# Altium project HORNET-1-IPG.PrjPcb
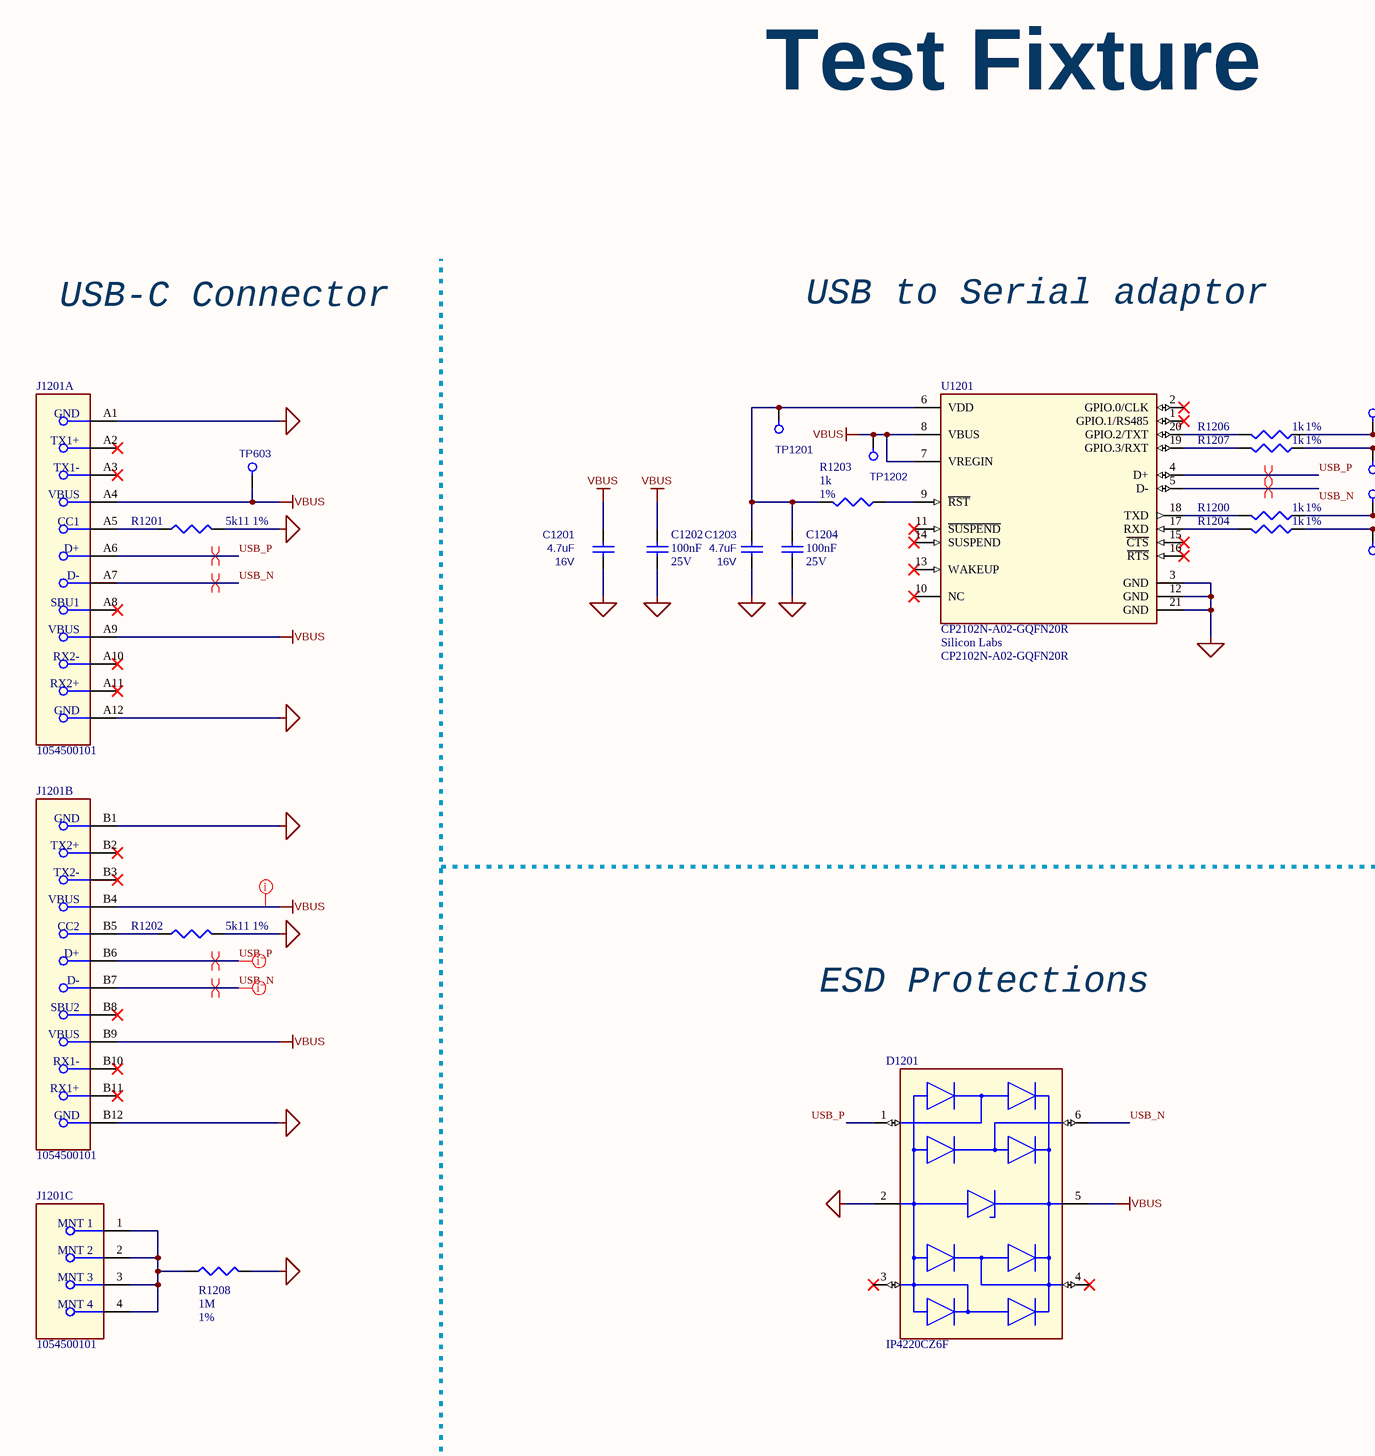
[diagram p0: 14-TestFixture.SchDoc, left]
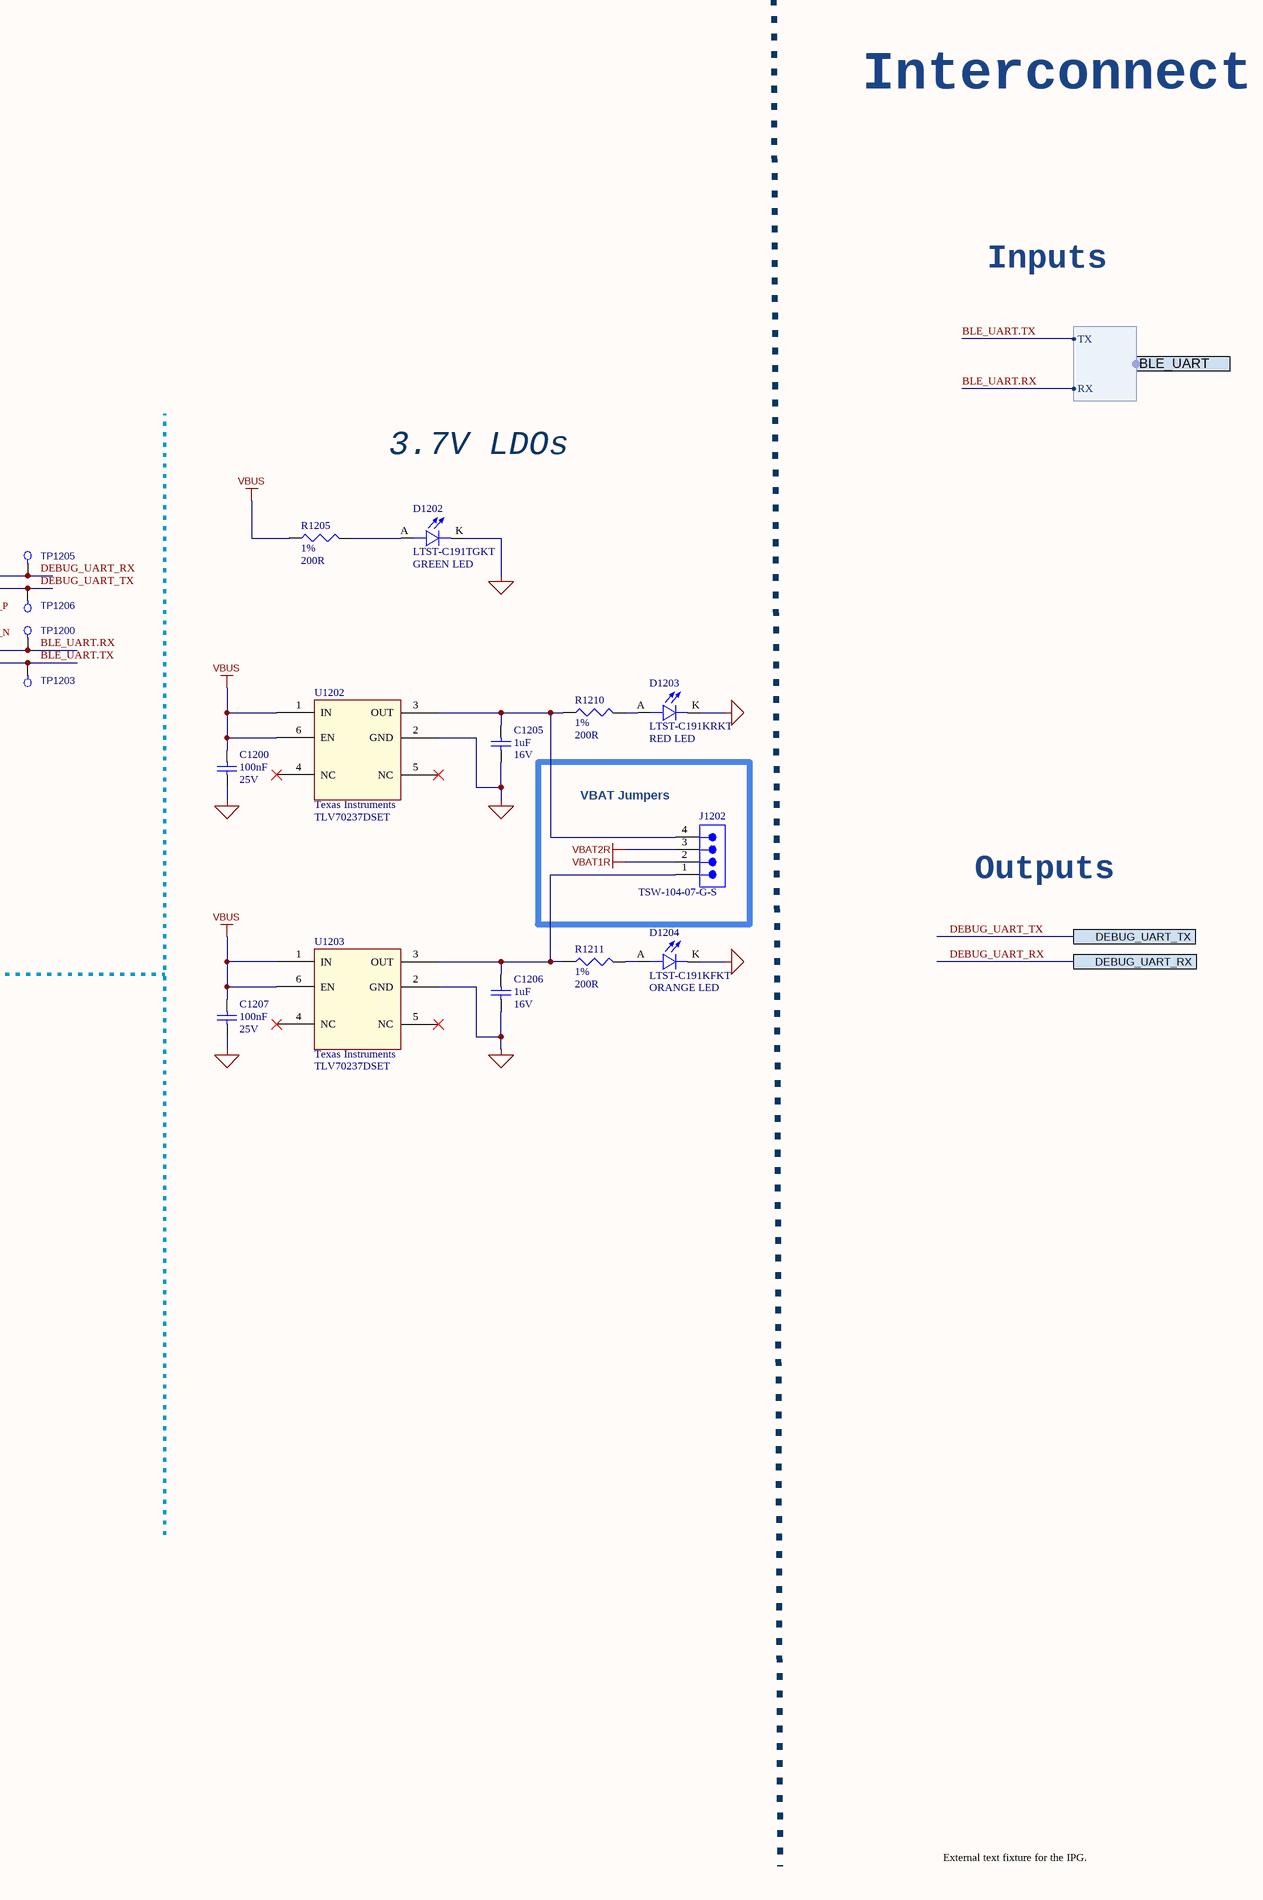
[diagram p1: 14-TestFixture.SchDoc, right]
ApprovedBy: Ricardo Ercoli; Date: 2024-05-16; DateReview1: 2024-05-16; LastDesigner: Mathias Ferreira; LastReviewer: Alvaro Rios; PCBA: HORNET1-IPGV1.4A; Rev: A; VerMay: 1; VerMin: 4
1 sheet, 35 parts. Net scope: flat (ports and power ports of the same name join across sheets).
Board files: HORNET-1-IPG.PcbDoc, non-rigid-reference.PcbDoc

## Sheet 14-TestFixture.SchDoc: Test Fixture
size A2; Date: 26/12/2023; DocumentNumber: 14; SheetNumber: 14; SheetTotal: 15; SPICEModelCacheUDWTZYBE: <root> / <DocumentId>UDWTZYBE</DocumentId> / </root>

### Parts
C1200  value 100nF  Rated DC Voltage (URdc): 25V  [C0201_C]  (hidden comment: GRM033R61E104KE14J)
C1201  value 4.7uF  Rating: 16V  [CAP0603_REDUCED]  (hidden comment: GRM188R61C475KE11)
C1202  value 100nF  Rated DC Voltage (URdc): 25V  [C0201_C]  (hidden comment: GRM033R61E104KE14J)
C1203  value 4.7uF  Rating: 16V  [CAP0603_REDUCED]  (hidden comment: GRM188R61C475KE11)
C1204  value 100nF  Rated DC Voltage (URdc): 25V  [C0201_C]  (hidden comment: GRM033R61E104KE14J)
C1205  value 1uF  Rated DC Voltage (URdc): 16V  [C0201_C]  (hidden comment: GRM033R61C105ME15D)
C1206  value 1uF  Rated DC Voltage (URdc): 16V  [C0201_C]  (hidden comment: GRM033R61C105ME15D)
C1207  value 100nF  Rated DC Voltage (URdc): 25V  [C0201_C]  (hidden comment: GRM033R61E104KE14J)
D1201  IP4220CZ6F  [FP-SOT457-IPC_A]
D1202  LTST-C191TGKT  value GREEN LED  [LEDC0603]
D1203  LTST-C191KRKT  value RED LED  [LEDC0603]
D1204  LTST-C191KFKT  value ORANGE LED  [LEDC0603]
J1201  1054500101  [FP-1054500101-MFG]  (parts A,B,C of 3)
J1202  TSW-104-07-G-S  [SMTC-TSW-104-07-X-S]
R1200  value 1k  Tolerance: 1%  [R0201_C]  (hidden comment: CRCW02011K00FNED)
R1201  value 5k11  Tolerance: 1%  [R0201_C]  (hidden comment: CRCW02015K11FNED)
R1202  value 5k11  Tolerance: 1%  [R0201_C]  (hidden comment: CRCW02015K11FNED)
R1203  value 1k  Tolerance: 1%  [R0201_C]  (hidden comment: CRCW02011K00FNED)
R1204  value 1k  Tolerance: 1%  [R0201_C]  (hidden comment: CRCW02011K00FNED)
R1205  value 200R  Tolerance: 1%  [RES0402_REDUCED]  (hidden comment: CRCW0402200RFKEDHP)
R1206  value 1k  Tolerance: 1%  [R0201_C]  (hidden comment: CRCW02011K00FNED)
R1207  value 1k  Tolerance: 1%  [R0201_C]  (hidden comment: CRCW02011K00FNED)
R1208  value 1M  Tolerance: 1%  [R0201_C]  (hidden comment: CRCW02011M00FNED)
R1210  value 200R  Tolerance: 1%  [RES0402_REDUCED]  (hidden comment: CRCW0402200RFKEDHP)
R1211  value 200R  Tolerance: 1%  [RES0402_REDUCED]  (hidden comment: CRCW0402200RFKEDHP)
TP603  Test Point  [testpad_0.9mm]  (value not drawn)  (no BOM)
TP1200  Test Point  [testpad_0.9mm]  (value not drawn)  (no BOM)
TP1201  Test Point  [testpad_0.9mm]  (value not drawn)  (no BOM)
TP1202  Test Point  [testpad_0.9mm]  (value not drawn)  (no BOM)
TP1203  Test Point  [testpad_0.9mm]  (value not drawn)  (no BOM)
TP1205  Test Point  [testpad_0.9mm]  (value not drawn)  (no BOM)
TP1206  Test Point  [testpad_0.9mm]  (value not drawn)  (no BOM)
U1201  CP2102N-A02-GQFN20R  Manufacturer: Silicon Labs  [FP-CP2102N-A02-GQFN20R-MFG]
U1202  Manufacturer: Texas Instruments  [SON127P600-8N]  (hidden comment: TLV70237DSET)
U1203  Manufacturer: Texas Instruments  [SON127P600-8N]  (hidden comment: TLV70237DSET)

### Ports
BLE_UART (harness UART), DEBUG_UART_RX, DEBUG_UART_TX

### Harnesses
UART: TX, RX

### Nets
GND: C1200.1 C1201.2 C1202.1 C1203.2 C1204.1 C1205.2 C1206.1 C1207.1 D1201.2(GND) D1202.K D1203.K D1204.K J1201.A1(GND) J1201.A12(GND) J1201.B1(GND) J1201.B12(GND) R1201.2 R1202.2 R1208.2 U1201.3(GND) U1201.12(GND) U1201.21(GND) U1202.2(GND) U1203.2(GND)
VBAT1R: J1202.2
VBAT2R: J1202.3
VBUS: C1200.2 C1201.1 C1202.2 C1207.2 D1201.5(VP) J1201.A4(VBUS) J1201.A9(VBUS) J1201.B4(VBUS) J1201.B9(VBUS) R1205.1 TP603.1 TP1202.1 U1201.7(VREGIN) U1201.8(VBUS) U1202.1(IN) U1202.6(EN) U1203.1(IN) U1203.6(EN)
BLE_UART.RX: R1200.1 TP1200.1 ; port BLE_UART.RX
BLE_UART.TX: R1204.1 TP1203.1 ; port BLE_UART.TX
DEBUG_UART_RX: R1206.1 TP1205.1 ; port DEBUG_UART_RX
DEBUG_UART_TX: R1207.1 TP1206.1 ; port DEBUG_UART_TX
USB_N: D1201.6(I/O4) J1201.A7(D-) J1201.B7(D-) U1201.5(D-)
USB_P: D1201.1(I/O1) J1201.A6(D+) J1201.B6(D+) U1201.4(D+)
NetC1203_1: C1203.1 C1204.2 R1203.2 TP1201.1 U1201.6(VDD)
NetC1205_1: C1205.1 J1202.4 R1210.1 U1202.3(OUT)
NetC1206_2: C1206.2 J1202.1 R1211.1 U1203.3(OUT)
NetD1202_A: D1202.A R1205.2
NetD1203_A: D1203.A R1210.2
NetD1204_A: D1204.A R1211.2
NetJ1201_1: J1201.1(MNT_1) J1201.2(MNT_2) J1201.3(MNT_3) J1201.4(MNT_4) R1208.1
NetJ1201_A5: J1201.A5(CC1) R1201.1
NetJ1201_B5: J1201.B5(CC2) R1202.1
NetR1200_2: R1200.2 U1201.18(TXD)
NetR1203_1: R1203.1 U1201.9(~{RST})
NetR1204_2: R1204.2 U1201.17(RXD)
NetR1206_2: R1206.2 U1201.20(GPIO.2/TXT)
NetR1207_2: R1207.2 U1201.19(GPIO.3/RXT)

Not connected (* = marked no-connect by the designer): D1201 3(I/O2)* 4(I/O3)*; J1201 A2(TX1+)* A3(TX1-)* A8(SBU1)* A10(RX2-)* A11(RX2+)* B2(TX2+)* B3(TX2-)* B8(SBU2)* B10(RX1-)* B11(RX1+)*; U1201 1(GPIO.1/RS485)* 2(GPIO.0/CLK)* 10(NC)* 11(~{SUSPEND})* 13(WAKEUP)* 14(SUSPEND)* 15(~{CTS})* 16(~{RTS})*; U1202 4(NC)* 5(NC)*; U1203 4(NC)* 5(NC)*

### Layout directives
differential pair: USB_N, USB_P
net class DIGITAL: USB_N, USB_P
rule Supply Nets [Voltage = 5.000]: VBUS

### Notes on the sheet
- Interconnect
- Test Fixture
- Inputs
- USB-C Connector
- USB to Serial adaptor
- 3.7V LDOs
- (near J1202) VBAT Jumpers
- Outputs
- ESD Protections
- External text fixture for the IPG.
- Project:
- Schematic:
- Design by:
- Date:
- Ver:
- .
- Comments:
- Reviewed by:

### Library data of the parts
C1200 C1202 C1204 C1207 = GRM033R61E104KE14J: Ceramic Capacitor, Multilayer, Ceramic, 25V, 10% +Tol, 10% -Tol, X5R, 15% TC, 0.1uF, Surface Mount, 0201; Manufacturer: Murata; Multilayer: Yes; Category: Ceramic Capacitors; Supplier: Digikey; Supplier Part Number: 490-14571-1-ND; Manufacturer Part Number: GRM033R61E104KE14J; RoHS: Yes; Stock: 1540851; Pricing: 1=0,1, 10=0,033, 50=0,0192, 100=0,0148, 500=0,01118, 1000=0,00878, 2500=0,00798, 5000=0,00734 (USD); Mounting Technology: Surface Mount; Pins: 2; Dielectric Material: Ceramic; Package Shape: Rectangular; Case/Package: 0201; Terminal Finish: Nickel; Min Operating Temperature: -55°C; Max Operating Temperature: 85°C; JESD-609 Code: e3; Capacitor Type: Ceramic; Tolerance  (fill in as +-): 10%; Package Style: SMTMeter; Packaging: Tape and Reel; Tolerance (fill in as +-): 10%; Temperature Characteristics Code: X5R; Termination: Wraparound; Length: 0.6mm; Width: 0.3mm; Height: 0.3mm; Reach SVHC Compliant: Yes; RoHS Compliant: Yes; ComponentLink1URL: https://psearch.en.murata.com:443/capacitor/product/GRM033R61E104KE14%23.pdf?src-supplier=IHS+Markit; ComponentLink1Description: https://psearch.en.murata.com:443/capacitor/product/GRM033R61E104KE14%23.pdf?src-supplier=IHS+Markit; ComponentLink2URL: http://www.mouser.com/ds/2/281/c02e-2905.pdf?src-supplier=Mouser; ComponentLink2Description: http://www.mouser.com/ds/2/281/c02e-2905.pdf?src-supplier=Mouser; ComponentLink3URL: http://search.murata.co.jp/Ceramy/image/img/A01X/G101/ENG/GRM033R61E104KE14-01.pdf?src-supplier=Digikey; ComponentLink3Description: http://search.murata.co.jp/Ceramy/image/img/A01X/G101/ENG/GRM033R61E104KE14-01.pdf?src-supplier=Digikey; ComponentLink4URL: https://search.murata.co.jp/Ceramy/image/img/A01X/G101/ENG/GRM033R61E104KE14-01.pdf?src-supplier=Digikey; ComponentLink4Description: https://search.murata.co.jp/Ceramy/image/img/A01X/G101/ENG/GRM033R61E104KE14-01.pdf?src-supplier=Digikey; Supplier 1: Arrow Electronics; Supplier Part Number 1: GRM033R61E104KE14J
C1201 C1203 = GRM188R61C475KE11: Capacitor, 4.7uF, X5R, 16V, 10%, 0603, Implant-grade; Manufacturer: Murata; Medical Grade MFR PN: GCH188R61C475KE11; Length (mm): 1.60 ±0.10; Medical Grade MFR: Murata; PCB Footprint: cap0603_reduced; Thickness (mm): 0.80 ±0.10; Width (mm): 0.80 ±0.10; Category: Capacitor; Package Description: 0603; Check: *; Supplier 1: Arrow Electronics; Supplier Part Number 1: GRM188R61C475KE11D; Status: *; Review: *; Manufacturer Part Number: GRM188R61C475KE11
C1205 C1206 = GRM033R61C105ME15D: Ceramic Capacitor, Multilayer, Ceramic, 16V, 20% +Tol, 20% -Tol, X5R, 15% TC, 1uF, Surface Mount, 0201; Manufacturer: Murata; Category: Ceramic Capacitors; Supplier: Digikey; Supplier Part Number: 490-18654-1-ND; Manufacturer Part Number: GRM033R61C105ME15D; RoHS: No; Stock: 132893; Pricing: 1=0,16, 10=0,105, 50=0,0628, 100=0,0493, 500=0,03644, 1000=0,03017, 2500=0,02808, 5000=0,02569 (USD); Supplier 1: Avnet; Supplier Part Number 1: GRM033R61C105ME15D
D1201 = IP4220CZ6F: TVS DIODE 5.5VWM 6TSOP; Manufacturer: Nexperia; RoHS Compliant: Yes; Manufacturer Part Number: IP4220CZ6F; Supplier 1: Digikey; Supplier Part Number 1: 1727-2751-1-ND
D1202 = LED GREEN CLEAR SMD 0603: LED, GREEN, SMD, 0603, 3.2V, 20mA; Manufacturer: Lite-On Inc.; Power Rating: 76mW; Wavelength: 525nm; Category: LED; Manufacturer Part Number: LTST-C191TGKT; Size Code: 0603; Supplier: Digi-Key; Supplier Part Number: 160-1888-2-ND; Height: 0.55mm; Width: 0.80mm; Length: 1.60mm; Forward Voltage: 3.2V; Forward Current: 20mA; Supplier 1: Digikey; Supplier Part Number 1: 160-1888-2-ND
D1203 = LED RED CLEAR SMD 0603: LED, RED, SMD, 0603, 2V, 30mA; Manufacturer: Lite-On Inc.; Power Rating: 75mW; Wavelength: 631nm; Category: LED; Manufacturer Part Number: LTST-C191KRKT; Size Code: 0603; Supplier: Digi-Key; Supplier Part Number: 160-1447-2-ND; Height: 0.55mm; Width: 0.80mm; Length: 1.60mm; Forward Voltage: 2V; Forward Current: 30mA; Supplier 1: Digikey; Supplier Part Number 1: 160-1447-2-ND
D1204 = LED ORANGE CLEAR SMD 0603: LED, ORANGE, SMD, 0603, 2V, 30mA; Manufacturer: Lite-On Inc.; Power Rating: 75mW; Wavelength: 605nm; Category: LED; Manufacturer Part Number: LTST-C191KFKT; Size Code: 0603; Supplier: Digi-Key; Supplier Part Number: 160-1445-2-ND; Height: 0.55mm; Width: 0.80mm; Length: 1.60mm; Forward Voltage: 2V; Forward Current: 30mA; Supplier 1: Digikey; Supplier Part Number 1: 160-1445-2-ND
J1201 = CMP-04767-000004-1: CONN RCP USB3.1 TYPEC 24P SMD RA; Manufacturer: Molex; Number Of Contacts: 24; Voltage Rating: 30V; Shielding: true; Is Female: yes; Current Rating: 0.25/1.25/5A; Pitch: 0.5mm; Conn Orientation: Right Angle; Package: 0; Height: 3.44mm; Footprint Url: https://www.molex.com/pdm_docs/sd/1054500101_sd.pdf; Device Class L1: Connectors; Category: Conn; Device Class L2: USB Connectors; Digikey Description: CONN RCP USB3.1 TYPEC 24P SMD RA; Contact Material: Gold,Nickel; Mouser Description: USB Shielded I/O Receptacle; Type C; Right Angle; Surface Mount; Gold over Nickel; ComponentLink2Description: Datasheet; Lead Free: Yes; Automotive: No; Temperature Range High: +85°C; RoHS: TRUE; Octopart: https://octopart.com/105450-0101-molex-68082325; ComponentLink2URL: https://www.molex.com/webdocs/datasheets/pdf/en-us/1054500101_IO_CONNECTORS.pdf; Temperature: -30°C to +85°C; Usb Standard: USB 3.1; Temperature Range Low: -30°C; Device Class L3: unset; Manufacturer Part Number: 1054500101; Supplier 1: Mouser; Supplier Part Number 1: 538-105450-0101
J1202 = TSW-104-07-G-S: Board Connector, 4 Contact(s), 1 Row(s), Male, Straight, 0.1 inch Pitch, Solder Terminal, Black Insulator, Receptacle; Manufacturer: Samtec; PartNumber: TSW-106-07-G-S; Pitch: 2.54 mm; Option: General Purpose; Filter Feature: No; Number of Rows Loaded: 1; Number of Contacts: 4; Additional Feature: E.L.P.; Contact Pattern: RECTANGULAR; Contact Style: SQ PIN-SKT; Mating Information: MULTIPLE MATING PARTS AVAILABLE; Plating Thickness: 10uin; Reference Standard: UL; Reliability: COMMERCIAL; RoHS: True; ComponentLink1Description: Manufacturer URL; DatasheetVersion: F-214; Orientation: Vertical; ComponentLink1URL: http://www.samtec.com; ComponentLink3Description: Package Specification; ComponentLink2Description: Datasheet; PackageVersion: DM, 8/1988; PackageDescription: .025[0.64] SQ. Post Terminal Strip Assembly; PackageReference: TSW-106-07-X-S; Mounting Technology: Through-hole; Temperature Range: -55 to 125 degC; ComponentLink3URL: http://www.samtec.com/documents/webfiles/cpdf/TSW-XXX-XX-XXX-X-XX-XXX-MKT.pdf; ComponentLink2URL: http://www.samtec.com/documents/webfiles/pdf/TSW_TH.PDF; Supplier: Arrow Electronics; Supplier Part Number: TSW-104-07-G-S; Manufacturer Part Number: TSW-104-07-G-S; Category: Board to Board Connectors; Stock: 5100; Pricing: 1=0,59, 50=0,46, 100=0,37, 500=0,32, 1000=0,24, 2000=0,21, 5000=0,15 (USD); Contact Finish - Termination: Gold (Au) - with Nickel (Ni) barrier; Contact Material: Bronze; Contact Finish - Mating: GOLD (10) OVER NICKEL (50); Insulation Color: Black; Insulation Material: Glass; Connector Type: BOARD CONNECTOR; JESD-609 Code: e4; Contact Gender: Male; Mixed Contacts: No; Mounting Style: STRAIGHT; Termination: Solder; Number Of Connectors: 1; Number Of PCB Rows: 1; PCB Contact Pattern: RECTANGULAR; Body/Shell Style: RECEPTACLE; Terminal Pitch: 2.54mm; Mating Contact Pitch: 0.1inch; Body Breadth: 0.1inch; Body Depth: 0.1inch; Terminal Length: 0.1inch; Flammability Rating: UL94 V-0; DIN Conformance: No; IEC Conformance: No; MIL Conformance: No; Reach SVHC Compliant: Yes; RoHS Compliant: Yes; ComponentLink4URL: https://datasheet.ciiva.com:443/pdfs/VipMasterIC/IC/SAMI/SAMI-S-A0003531373/SAMI-S-A0003531373-1.pdf?src-supplier=IHS+Markit; ComponentLink4Description: https://datasheet.ciiva.com:443/pdfs/VipMasterIC/IC/SAMI/SAMI-S-A0003531373/SAMI-S-A0003531373-1.pdf?src-supplier=IHS+Markit; ComponentLink5URL: https://datasheet.ciiva.com/6889/tsw-xxx-xx-xxx-x-xx-xxx-mkt-6889291.pdf?src-supplier=Digi-Key; ComponentLink5Description: https://datasheet.ciiva.com/6889/tsw-xxx-xx-xxx-x-xx-xxx-mkt-6889291.pdf?src-supplier=Digi-Key; Supplier 1: Digikey; Supplier Part Number 1: SAM1029-04-ND
R1200 R1203 R1204 R1206 R1207 = CRCW02011K00FNED: Fixed Resistor, Metal Glaze/thick Film, 0.05W, 1000ohm, 30V, 1% +/-Tol, 200ppm/Cel, Surface Mount, 0201; Manufacturer: Vishay; Medical Grade MFR: Mini-Systems; Medical Grade MFR PN: MWA96SM-1001F-NS62TR; Power: 50mW; Rated Temperature: 70°C; Temperature Coefficient: 200ppm/°C; Package Height: 0.23mm; Package Length: 0.6mm; Package Width: 0.3mm; Reference Standard: AEC-Q200; Category: Chip SMD Resistors; Supplier: Digikey; Supplier Part Number: 541-1.00KABCT-ND; Manufacturer Part Number: CRCW02011K00FNED; RoHS: Yes; Stock: 303224; Pricing: 1=0,1, 10=0,037, 50=0,0242, 100=0,0204, 500=0,01426, 1000=0,01241, 5000=0,00924 (USD); Mounting Technology: Surface Mount; Pins: 2; Package Shape: Rectangular; Case/Package: 0201; Terminal Finish: Nickel; Min Operating Temperature: -55°C; Max Operating Temperature: 155°C; JESD-609 Code: e3; Resistor Type: FIXED RESISTOR; Construction: Chip; Package Style: SMTMeter; Packaging: Tape and Reel; Technology: METAL GLAZE/THICK FILM; Termination: Wraparound; Working Voltage: 30V; Reach SVHC Compliant: Yes; RoHS Compliant: Yes; ComponentLink1URL: https://datasheet.ciiva.com:443/pdfs/VipMasterIC/IC/VISH/VISH-S-A0002932828/VISH-S-A0002932828-1.pdf?src-supplier=IHS+Markit; ComponentLink1Description: https://datasheet.ciiva.com:443/pdfs/VipMasterIC/IC/VISH/VISH-S-A0002932828/VISH-S-A0002932828-1.pdf?src-supplier=IHS+Markit; ComponentLink2URL: https://datasheet.ciiva.com/7983/1719906-7983324.pdf?src-supplier=Element14; ComponentLink2Description: https://datasheet.ciiva.com/7983/1719906-7983324.pdf?src-supplier=Element14; ComponentLink3URL: https://datasheet.ciiva.com/7983/1719906-7983323.pdf?src-supplier=Element14; ComponentLink3Description: https://datasheet.ciiva.com/7983/1719906-7983323.pdf?src-supplier=Element14; ComponentLink4URL: https://datasheet.ciiva.com/22692/1719906-22692751.pdf?src-supplier=Element14; ComponentLink4Description: https://datasheet.ciiva.com/22692/1719906-22692751.pdf?src-supplier=Element14; ComponentLink5URL: https://datasheet.ciiva.com/22665/1825492-22665818.pdf?src-supplier=Element14; ComponentLink5Description: https://datasheet.ciiva.com/22665/1825492-22665818.pdf?src-supplier=Element14; ComponentLink6URL: https://datasheet.ciiva.com/2474/crcw0201e3-2474801.pdf?src-supplier=Digikey; ComponentLink6Description: https://datasheet.ciiva.com/2474/crcw0201e3-2474801.pdf?src-supplier=Digikey; ComponentLink7URL: https://datasheet.ciiva.com/2474/crcw0201e3-2474802.pdf?src-supplier=Digikey; ComponentLink7Description: https://datasheet.ciiva.com/2474/crcw0201e3-2474802.pdf?src-supplier=Digikey; ComponentLink8URL: https://datasheet.ciiva.com/2474/crcw0201e3-2474800.pdf?src-supplier=Digikey; ComponentLink8Description: https://datasheet.ciiva.com/2474/crcw0201e3-2474800.pdf?src-supplier=Digikey; ComponentLink9URL: https://datasheet.ciiva.com/22871/70202042-22871422.pdf?src-supplier=Allied+Electronics; ComponentLink9Description: https://datasheet.ciiva.com/22871/70202042-22871422.pdf?src-supplier=Allied+Electronics; ComponentLink10URL: https://datasheet.ciiva.com/3255/crcw0201e3-3255929.pdf?src-supplier=Avnet; ComponentLink10Description: https://datasheet.ciiva.com/3255/crcw0201e3-3255929.pdf?src-supplier=Avnet; Supplier 1: Arrow Electronics; Supplier Part Number 1: CRCW02011K00FNED
R1201 R1202 = CRCW02015K11FNED: Fixed Resistor, Metal Glaze/thick Film, 0.05W, 5110ohm, 30V, 1% +/-Tol, 200ppm/Cel, Surface Mount, 0201; Manufacturer: Vishay; Medical Grade MFR: Mini-Systems; Medical Grade MFR PN: MWA96SM-5111F-NS62TR; Temperature Coefficient: 200ppm/°C; Power: 50mW; Rated Temperature: 70°C; Package Height: 0.23mm; Package Length: 0.6mm; Package Width: 0.3mm; Reference Standard: AEC-Q200; Packaging: Tape and Reel; Termination: Wraparound; Max Operating Temperature: 155°C; Case/Package: 0201; Min Operating Temperature: -55°C; Supplier: Digikey; Supplier Part Number: 541-CRCW02015K11FNEDCT-ND; Manufacturer Part Number: CRCW02015K11FNED; RoHS: Yes; Category: Chip SMD Resistors; Stock: 23740; Pricing: 1=0,1, 10=0,037, 50=0,0242, 100=0,0204, 500=0,01426, 1000=0,01241, 5000=0,00924 (USD); Mounting Technology: Surface Mount; Pins: 2; Package Shape: Rectangular; Terminal Finish: Nickel; JESD-609 Code: e3; Resistor Type: FIXED RESISTOR; Construction: Chip; Package Style: SMTMeter; Technology: METAL GLAZE/THICK FILM; Working Voltage: 30V; Reach SVHC Compliant: Yes; RoHS Compliant: Yes; ComponentLink1URL: https://datasheet.ciiva.com:443/pdfs/VipMasterIC/IC/VISH/VISH-S-A0002932828/VISH-S-A0002932828-1.pdf?src-supplier=IHS+Markit; ComponentLink1Description: https://datasheet.ciiva.com:443/pdfs/VipMasterIC/IC/VISH/VISH-S-A0002932828/VISH-S-A0002932828-1.pdf?src-supplier=IHS+Markit; ComponentLink2URL: https://datasheet.ciiva.com/2577/crcw0201e3-2577232.pdf?src-supplier=Digikey; ComponentLink2Description: https://datasheet.ciiva.com/2577/crcw0201e3-2577232.pdf?src-supplier=Digikey; ComponentLink3URL: https://datasheet.ciiva.com/9067/crcw0201e3-9067501.pdf?src-supplier=Avnet; ComponentLink3Description: https://datasheet.ciiva.com/9067/crcw0201e3-9067501.pdf?src-supplier=Avnet; ComponentLink4URL: https://datasheet.ciiva.com/22707/1719906-22707711.pdf?src-supplier=Element14; ComponentLink4Description: https://datasheet.ciiva.com/22707/1719906-22707711.pdf?src-supplier=Element14; ComponentLink5URL: https://datasheet.ciiva.com/7690/1719906-7690629.pdf?src-supplier=Element14; ComponentLink5Description: https://datasheet.ciiva.com/7690/1719906-7690629.pdf?src-supplier=Element14; Supplier 1: Digikey; Supplier Part Number 1: 541-CRCW02015K11FNEDCT-ND
R1205 R1210 R1211 = CRCW0402200RFKEDHP: Resistor 200 1%, 0402, Non Implant-grade; Manufacturer: Vishay; Medical Grade Manufacturer: None; Power: 200 mW; Temperature Coefficient: 100 ppm/°C; Voltage Rating: 50V; Category: Resistor; Manufacturer Part Number: CRCW0402200RFKEDHP; Medical Grade Manufacturer Part Number: None; Size Code: 0402; Supplier: TBD; Supplier Part Number: TBD; Height: 0.3mm; Width: 0.5mm; Length: 1mm; Supplier 1: Mouser; Supplier Part Number 1: 71-CRCW0402200RFKEDH; Supplier 2: Digikey; Supplier Part Number 2: 541-200YCT-ND; Supplier 3: Digikey; Supplier Part Number 3: 541-200YDKR-ND; Supplier 4: Digikey; Supplier Part Number 4: 541-200YTR-ND
R1208 = CRCW02011M00FNED: Fixed Resistor, Metal Glaze/thick Film, 0.05W, 1000000ohm, 30V, 1% +/-Tol, 200ppm/Cel, Surface Mount, 0201; Manufacturer: Vishay; Medical Grade MFR: Mini-Systems; Medical Grade MFR PN: MWA96SM-1004F-NS62TR; Power: 50mW; Rated Temperature: 70°C; Temperature Coefficient: 200ppm/°C; Package Height: 0.23mm; Package Length: 0.6mm; Package Width: 0.3mm; Reference Standard: AEC-Q200; Category: Chip SMD Resistors; Supplier: Digikey; Supplier Part Number: 541-1.00MABCT-ND; Manufacturer Part Number: CRCW02011M00FNED; RoHS: Yes; Stock: 392914; Pricing: 1=0,1, 10=0,037, 50=0,0242, 100=0,0204, 500=0,01426, 1000=0,01241, 5000=0,00924 (USD); Mounting Technology: Surface Mount; Pins: 2; Package Shape: Rectangular; Case/Package: 0201; Terminal Finish: Nickel; Min Operating Temperature: -55°C; Max Operating Temperature: 155°C; JESD-609 Code: e3; Resistor Type: FIXED RESISTOR; Construction: Chip; Package Style: SMTMeter; Packaging: Tape and Reel; Technology: METAL GLAZE/THICK FILM; Termination: Wraparound; Working Voltage: 30V; Reach SVHC Compliant: Yes; RoHS Compliant: Yes; ComponentLink1URL: https://datasheet.ciiva.com:443/pdfs/VipMasterIC/IC/VISH/VISH-S-A0002932828/VISH-S-A0002932828-1.pdf?src-supplier=IHS+Markit; ComponentLink1Description: https://datasheet.ciiva.com:443/pdfs/VipMasterIC/IC/VISH/VISH-S-A0002932828/VISH-S-A0002932828-1.pdf?src-supplier=IHS+Markit; ComponentLink2URL: https://datasheet.ciiva.com/7841/1719906-7841438.pdf?src-supplier=Element14; ComponentLink2Description: https://datasheet.ciiva.com/7841/1719906-7841438.pdf?src-supplier=Element14; ComponentLink3URL: https://datasheet.ciiva.com/7841/1719906-7841439.pdf?src-supplier=Element14; ComponentLink3Description: https://datasheet.ciiva.com/7841/1719906-7841439.pdf?src-supplier=Element14; ComponentLink4URL: https://datasheet.ciiva.com/7859/dcrcwe3-7859689.pdf?src-supplier=Element14; ComponentLink4Description: https://datasheet.ciiva.com/7859/dcrcwe3-7859689.pdf?src-supplier=Element14; ComponentLink5URL: https://datasheet.ciiva.com/16757/70202042-16757675.pdf?src-supplier=Allied+Electronics; ComponentLink5Description: https://datasheet.ciiva.com/16757/70202042-16757675.pdf?src-supplier=Allied+Electronics; ComponentLink6URL: https://datasheet.ciiva.com/22692/1719906-22692761.pdf?src-supplier=Element14; ComponentLink6Description: https://datasheet.ciiva.com/22692/1719906-22692761.pdf?src-supplier=Element14; ComponentLink7URL: https://datasheet.ciiva.com/9109/crcw0201e3-9109910.pdf?src-supplier=Avnet; ComponentLink7Description: https://datasheet.ciiva.com/9109/crcw0201e3-9109910.pdf?src-supplier=Avnet; ComponentLink8URL: https://datasheet.ciiva.com/22675/1847332-22675065.pdf?src-supplier=Element14; ComponentLink8Description: https://datasheet.ciiva.com/22675/1847332-22675065.pdf?src-supplier=Element14; ComponentLink9URL: https://datasheet.ciiva.com/2474/crcw0201e3-2474824.pdf?src-supplier=Digikey; ComponentLink9Description: https://datasheet.ciiva.com/2474/crcw0201e3-2474824.pdf?src-supplier=Digikey; ComponentLink10URL: https://datasheet.ciiva.com/2474/crcw0201e3-2474825.pdf?src-supplier=Digikey; ComponentLink10Description: https://datasheet.ciiva.com/2474/crcw0201e3-2474825.pdf?src-supplier=Digikey; ComponentLink11URL: https://datasheet.ciiva.com/2474/crcw0201e3-2474826.pdf?src-supplier=Digikey; ComponentLink11Description: https://datasheet.ciiva.com/2474/crcw0201e3-2474826.pdf?src-supplier=Digikey; Supplier 1: Digikey; Supplier Part Number 1: 541-1.00MABCT-ND
TP603 TP1200-TP1203 TP1205 TP1206 = Test Point: Test pad, 0.90mm circular pad; PCB Footprint: testpad_0p90mm; Length (mm): 0.90; Manufacturer: N/A; Manufacturer PN: N/A; Medical Grade MFR: N/A; Medical Grade MFR PN: N/A; Rating: N/A; Thickness (mm): N/A; Value: Test point; Width (mm): 0.90; Category: Test point; Status: *; Review: *
U1201 = CP2102N-A02-GQFN20R: IC USB TO UART BRIDGE QFN20; Supplier 1: Mouser; Supplier Part Number 1: 634-CP2102NA02QFN20R; Value: CP2102N-A02-GQFN20R; Manufacturer Part Number: CP2102N-A02-GQFN20R
U1202 U1203 = TLV70237DSET: Fixed Positive LDO Regulator, 3.7V, 0.375V Dropout, PDSO6; Package Body Material: Plastic; Max Supply Voltage: 5.5V; Min Input Voltage: 2V; Channels: 1; Output Current1-Max: 300mA; Output Voltage1-Max: 3.774V; Output Voltage1-Min: 3.626V; Regulator Type: FIXED POSITIVE SINGLE OUTPUT LDO REGULATOR; Supplier: Digi-Key; RoHS: Yes; Category: Voltage Regulators - Linear; Stock: 1935; Pricing: 1=1,11, 10=0,992, 25=0,9416, 100=0,7736 (USD); Case/Package: VSON; Pins: 6; Package Shape: Square; Terminal Finish: Nickel; JESD-609 Code: e4; JESD-30 Code: S-PDSO-N6; Moisture Sensitivity Level: 1; Operating Temperature, TJ-Max: 125°C; Operating Temperature, TJ-Min: -40°C; Output Voltage1-Nom: 3.7V; Package Style: SMALL OUTLINE, VERY THIN PROFILEMeter; Peak Reflow Temperature (Cel): 260°C; Surface Mount: Yes; Terminal Form: No Lead; Terminal Position: DUAL; Length: 1.5mm; Width: 1.5mm; Height - Seated (Max): 0.8mm; Terminal Pitch: 0.5mm; Reach SVHC Compliant: Yes; RoHS Compliant: Yes; ComponentLink1URL: https://www.ti.com:443/lit/ds/symlink/tlv702.pdf?src-supplier=IHS+Markit; ComponentLink1Description: https://www.ti.com:443/lit/ds/symlink/tlv702.pdf?src-supplier=IHS+Markit; ComponentLink2URL: http://www.ti.com/lit/ds/symlink/tlv702.pdf?src-supplier=Digi-Key; ComponentLink2Description: http://www.ti.com/lit/ds/symlink/tlv702.pdf?src-supplier=Digi-Key; ComponentLink3URL: http://www.ti.com/lit/ds/symlink/tlv70237.pdf?src-supplier=Avnet; ComponentLink3Description: http://www.ti.com/lit/ds/symlink/tlv70237.pdf?src-supplier=Avnet; Supplier 1: Digi-Key; Supplier Part Number 1: 296-TLV70237DSETCT-ND; Supplier Part Number: 296-TLV70237DSETCT-ND; Manufacturer Part Number: TLV70237DSET

## Assembly variants
Pig Study-HORNET-1-IPG: not fitted J203 J1017 J1018 J1019 J1020 J1021 J1022 J1023 J1024 J1025 J1026 J1027 J1028 J1029 J1030 J1031 J1032 J1033 L400 L401 R507 R508
Roedent Study-HORNET-1-IPG: not fitted L400 L401 R507 R508